# Altium schematic sheet 10_Program_and_Debug_interface.SchDoc
size 420 x 297 mm; Author: Shpakov Dmitry; Address1: Address1; Address2: Address2; Address3: Address3; Address4: Address4; DocumentNumber: АБВГ.123456.001 Э3; SheetNumber: 11; SheetTotal: 13; Scale: 1:1; DocumentType: Схема электрическая принципиальная; FirstReferrence: АБВГ.123456.001
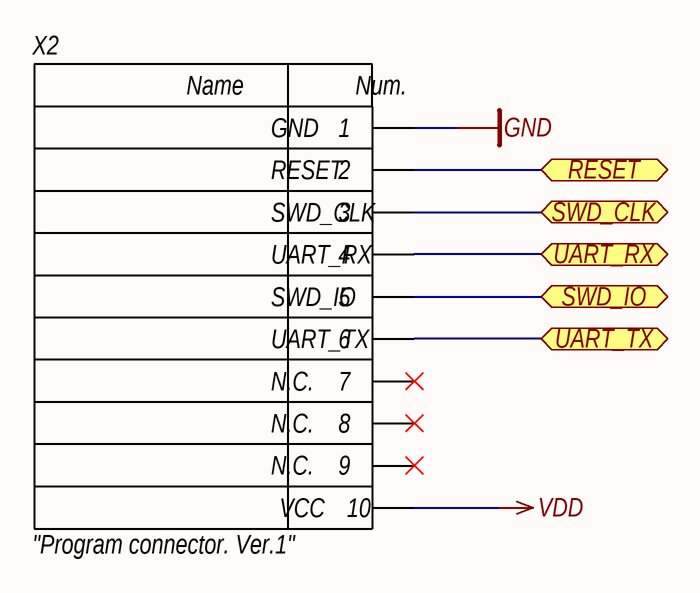
[diagram p0: 10_Program_and_Debug_interface.SchDoc]

## Parts
X2  "Program connector. Ver.1"  [10-pin 2.54mm TH]

## Ports
RESET, SWD_CLK, SWD_IO, UART_RX, UART_TX

## Nets
GND: X2.1(GND)
VDD: X2.10(VCC)
RESET: X2.2(RESET) ; port RESET
SWD_CLK: X2.3(SWD_CLK) ; port SWD_CLK
SWD_IO: X2.5(SWD_IO) ; port SWD_IO
UART_RX: X2.4(UART_RX) ; port UART_RX
UART_TX: X2.6(UART_TX) ; port UART_TX

Not connected (* = marked no-connect by the designer): X2 7(N.C.)* 8(N.C.)* 9(N.C.)*

## Notes on the sheet
- Author
- Manufacturer
- Date
- Page
- Total pages
- Size page
- A3
- Materials
- (in symbol 10-pin program connector. Ver.1) Name; Num.

## Library data of the parts
X2 = 10-pin program connector. Ver.1: 10-pin custom fixed layout program and debug connector.; Manufacturer: *; PartNumber: *; Help URL: *; Power/Voltage: *; Type: *; Value: *; Tolerance: *; Operation Temperature: *; Note: *; Case: *